# Altium schematic sheet 02_MCU.SchDoc
size A4
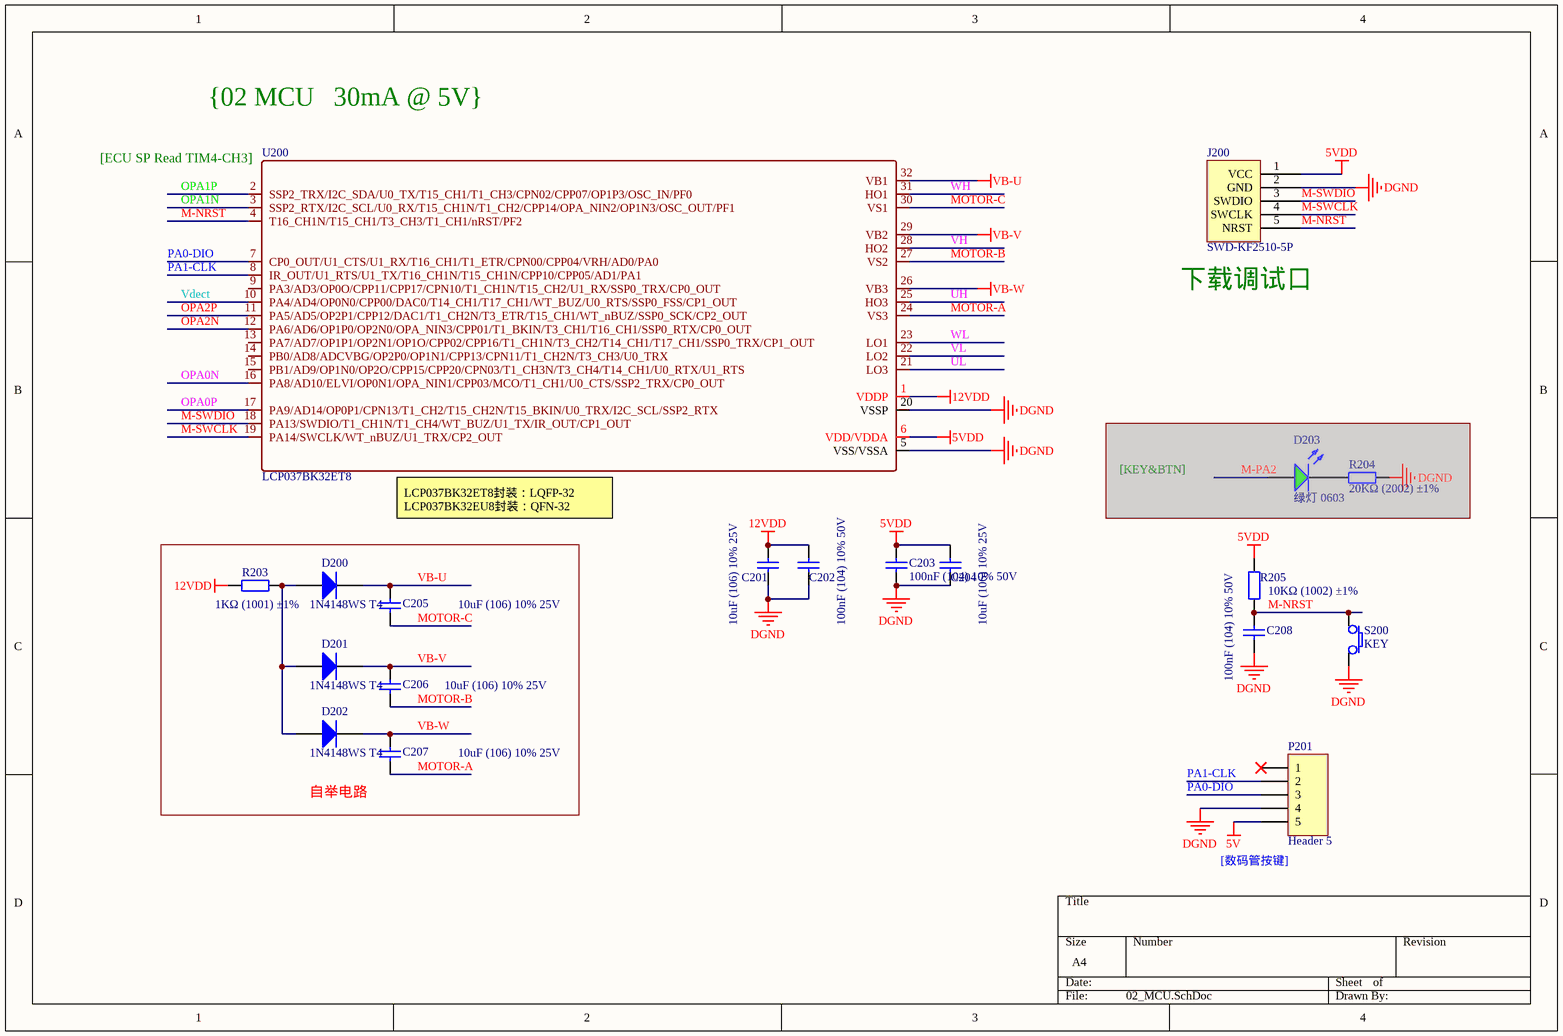
[diagram p0: 02_MCU.SchDoc]

## Parts
C201  10uF (106) 10% 25V  [0805_C]
C202  100nF (104) 10% 50V  [0603_C]
C203  100nF (104) 10% 50V  [0603_C]
C204  10uF (106) 10% 25V  [0805_C]
C205  10uF (106) 10% 25V  [0805_C]
C206  10uF (106) 10% 25V  [0805_C]
C207  10uF (106) 10% 25V  [0805_C]
C208  100nF (104) 10% 50V  [0603_C]
D200  1N4148WS T4  [SOD-323]
D201  1N4148WS T4  [SOD-323]
D202  1N4148WS T4  [SOD-323]
D203  绿灯 0603  [LC-0603_LED_S1]  (masked out: inside a compile mask, not in the netlist)
J200  SWD-KF2510-5P  [XH2.54-5P]
P201  Header 5  [XH2.54-5P]
R203  1KΩ (1001) ±1%  [0805_R]
R204  20KΩ (2002) ±1%  [LC-0603_R]  (masked out: inside a compile mask, not in the netlist)
R205  10KΩ (1002) ±1%  [0603_R]
S200  KEY  [按键3*4]
U200  LCP037BK32ET8  [LQFP32]

## Blocks framed on the sheet
自举电路: C205-C207 D200-D202 R203

## Nets
5V: P201.5
5VDD: C203.2 C204.2 J200.1(VCC) R205.2 U200.6(VDD/VDDA)
12VDD: C201.2 C202.2 R203.1 U200.1(VDDP)
DGND: C201.1 C202.1 C203.1 C204.1 C208.1 J200.2(GND) P201.4 S200.2 U200.5(VSS/VSSA) U200.20(VSSP)
VB-U: C205.2 D200.2(K) U200.32(VB1)
VB-V: C206.2 D201.2(K) U200.29(VB2)
VB-W: C207.2 D202.2(K) U200.26(VB3)
M-NRST: C208.2 J200.5(NRST) R205.1 S200.1 U200.4(T16_CH1N/T15_CH1/T3_CH3/T1_CH1/nRST/PF2)
M-SWCLK: J200.4(SWCLK) U200.19(PA14/SWCLK/WT_nBUZ/U1_TRX/CP2_OUT)
M-SWDIO: J200.3(SWDIO) U200.18(PA13/SWDIO/T1_CH1N/T1_CH4/WT_BUZ/U1_TX/IR_OUT/CP1_OUT)
MOTOR-A: C207.1 U200.24(VS3)
MOTOR-B: C206.1 U200.27(VS2)
MOTOR-C: C205.1 U200.30(VS1)
OPA0N: U200.16(PA8/AD10/ELVI/OP0N1/OPA_NIN1/CPP03/MCO/T1_CH1/U0_CTS/SSP2_TRX/CP0_OUT)
OPA0P: U200.17(PA9/AD14/OP0P1/CPN13/T1_CH2/T15_CH2N/T15_BKIN/U0_TRX/I2C_SCL/SSP2_RTX)
OPA1N: U200.3(SSP2_RTX/I2C_SCL/U0_RX/T15_CH1N/T1_CH2/CPP14/OPA_NIN2/OP1N3/OSC_OUT/PF1)
OPA1P: U200.2(SSP2_TRX/I2C_SDA/U0_TX/T15_CH1/T1_CH3/CPN02/CPP07/OP1P3/OSC_IN/PF0)
OPA2N: U200.12(PA6/AD6/OP1P0/OP2N0/OPA_NIN3/CPP01/T1_BKIN/T3_CH1/T16_CH1/SSP0_RTX/CP0_OUT)
OPA2P: U200.11(PA5/AD5/OP2P1/CPP12/DAC1/T1_CH2N/T3_ETR/T15_CH1/WT_nBUZ/SSP0_SCK/CP2_OUT)
PA0-DIO: P201.3 U200.7(CP0_OUT/U1_CTS/U1_RX/T16_CH1/T1_ETR/CPN00/CPP04/VRH/AD0/PA0)
PA1-CLK: P201.2 U200.8(IR_OUT/U1_RTS/U1_TX/T16_CH1N/T15_CH1N/CPP10/CPP05/AD1/PA1)
UH: U200.25(HO3)
UL: U200.21(LO3)
Vdect: U200.10(PA4/AD4/OP0N0/CPP00/DAC0/T14_CH1/T17_CH1/WT_BUZ/U0_RTS/SSP0_FSS/CP1_OUT)
VH: U200.28(HO2)
VL: U200.22(LO2)
WH: U200.31(HO1)
WL: U200.23(LO1)
NetD200_1: D200.1(A) D201.1(A) D202.1(A) R203.2

Not connected (* = marked no-connect by the designer): P201 1*; U200 9(PA3/AD3/OP0O/CPP11/CPP17/CPN10/T1_CH1N/T15_CH2/U1_RX/SSP0_TRX/CP0_OUT) 13(PA7/AD7/OP1P1/OP2N1/OP1O/CPP02/CPP16/T1_CH1N/T3_CH2/T14_CH1/T17_CH1/SSP0_TRX/CP1_OUT) 14(PB0/AD8/ADCVBG/OP2P0/OP1N1/CPP13/CPN11/T1_CH2N/T3_CH3/U0_TRX) 15(PB1/AD9/OP1N0/OP2O/CPP15/CPP20/CPN03/T1_CH3N/T3_CH4/T14_CH1/U0_RTX/U1_RTS)

## Notes on the sheet
- {02 MCU   30mA @ 5V}
- (near U200) [ECU SP Read TIM4-CH3]
- (near J200) 下载调试口
- (near U200) LCP037BK32ET8封装：LQFP-32
  LCP037BK32EU8封装：QFN-32
- [KEY&BTN]
- (near P201) [数码管按键]

## Library data of the parts
C201 C204-C207 = 0805 10uF (106) 10% 25V: 贴片电容; ComponentLink1Description: 供应商链接; ComponentLink1URL: http://www.szlcsc.com/product/details_16532.html; Package: 0805; Supplier: LC; SuppliersPartNumber: C15850
C202 C203 C208 = 0603 100nF (104) 10% 50V: 贴片电容; ComponentLink1Description: 供应商链接; ComponentLink1URL: http://www.szlcsc.com/product/details_15331.html; Package: 0603; Supplier: LC; SuppliersPartNumber: C14663
D200-D202 = SOD-323 1N4148WS T4: 二极管; ComponentLink1Description: 供应商链接; ComponentLink1URL: http://www.szlcsc.com/product/details_2485.html; Package: SOD-323; Supplier: LC; SuppliersPartNumber: C2128
D203 = 0603 绿灯: 发光二极管; ComponentLink1Description: 供应商链接; ComponentLink1URL: http://www.szlcsc.com/product/details_73152.html; Package: 0603; Supplier: LC; SuppliersPartNumber: C72043
J200 = ST-LINK-SWD
P201 = Header 5: Header, 5-Pin; LatestRevisionDate: 17-Jul-2002; LatestRevisionNote: Re-released for DXP Platform.; Publisher: Altium Limited
R203 = 0805 1KΩ (1001) 1%: 贴片电阻; ComponentLink1Description: 供应商链接; ComponentLink1URL: http://www.szlcsc.com/product/details_18201.html; Package: 0805; Supplier: LC; SuppliersPartNumber: C17513
R204 = 0603 20KΩ (2002) 1%: 贴片电阻; ComponentLink1Description: 供应商链接; ComponentLink1URL: http://www.szlcsc.com/product/details_4591.html; Package: 0603; Supplier: LC; SuppliersPartNumber: C4184
R205 = 0603 10KΩ (1002) 1%: 贴片电阻; ComponentLink1Description: 供应商链接; ComponentLink1URL: http://www.szlcsc.com/product/details_26547.html; Package: 0603; Supplier: LC; SuppliersPartNumber: C25804
U200 = LCP037BT32EU8